# Altium schematic sheet Stepper Motor6.SchDoc
size A2; SheetNumber: 9; SheetTotal: 9
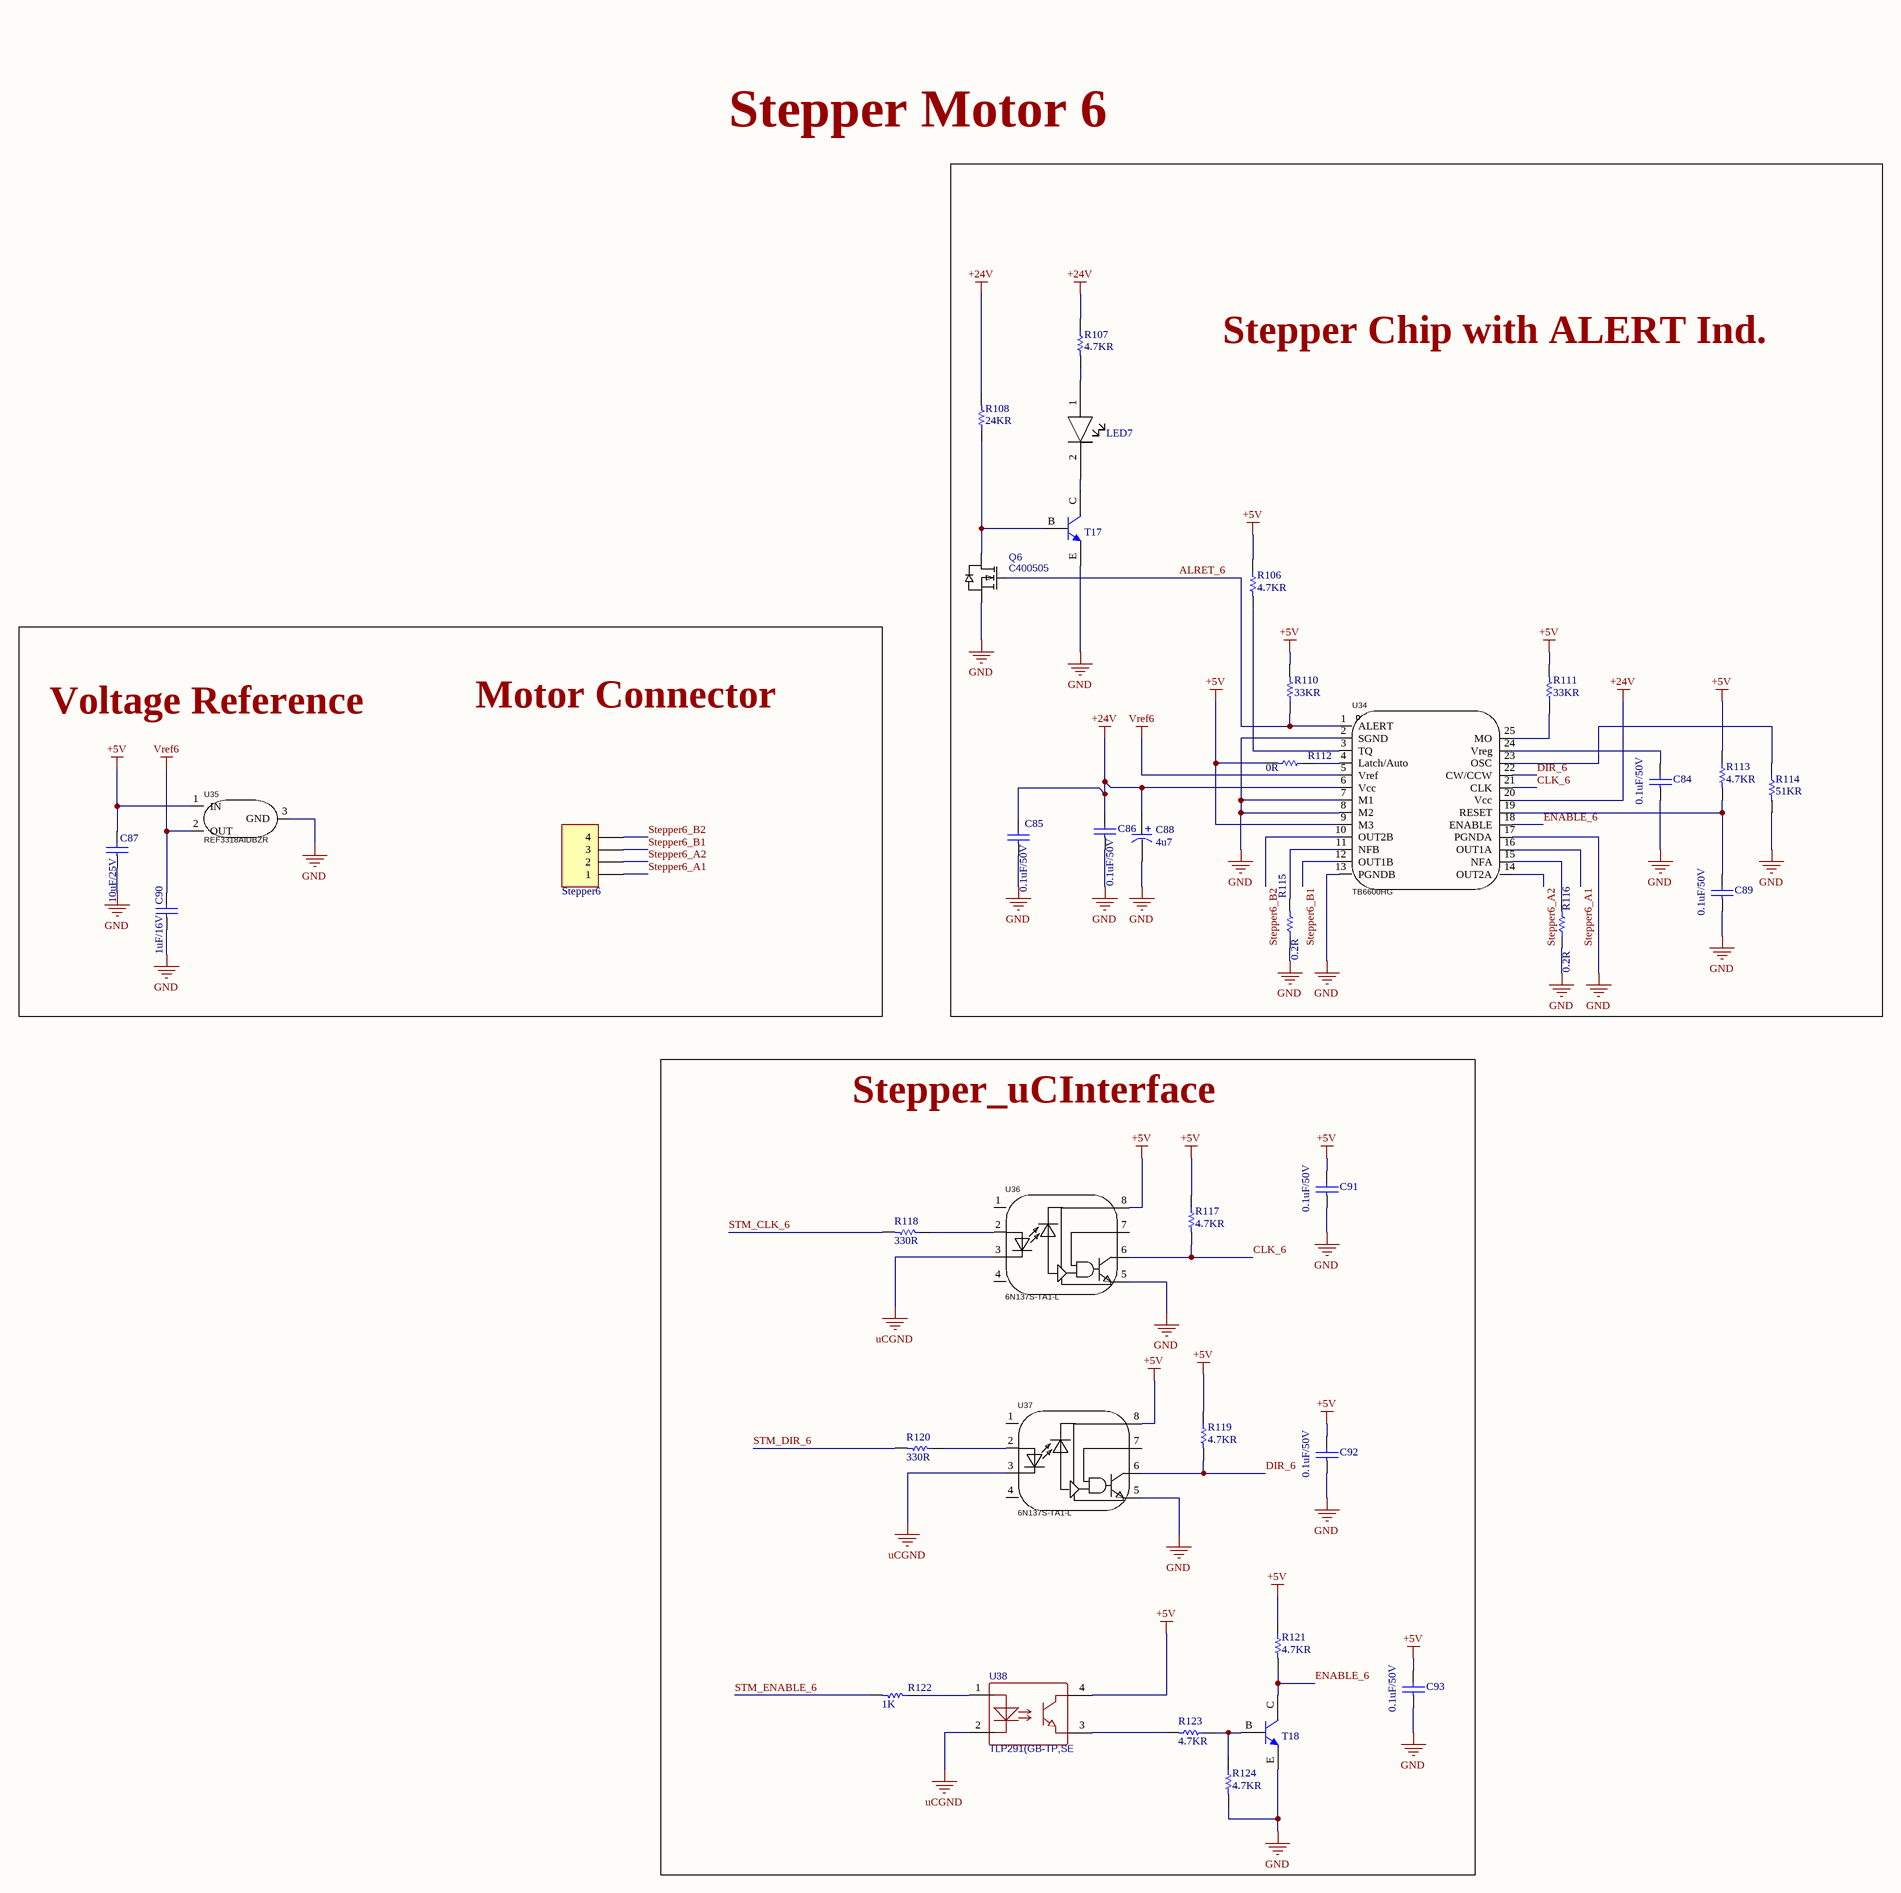
[diagram p0: Stepper Motor6.SchDoc]

## Parts
C84  0.1uF/50V  [PCBComponent_1]
C85  0.1uF/50V  [PCBComponent_1]
C86  0.1uF/50V  [PCBComponent_1]
C87  10uF/25V  [PCBComponent_1]
C88  4u7  [CAPLEAD_D6.3mm]
C89  0.1uF/50V  [PCBComponent_1]
C90  1uF/16V  [PCBComponent_1]
C91  0.1uF/50V  [PCBComponent_1]
C92  0.1uF/50V  [PCBComponent_1]
C93  0.1uF/50V  [PCBComponent_1]
LED7  1206 LED  [1206 LED]  (value not drawn)
Q6  C400505  [SOT-23-3_L2.9-W1.3-P1.90-LS2.4-BR]
R106  4.7KR  [R0402]
R107  4.7KR  [R0402]
R108  24KR  [RESC1608X06N]
R110  33KR  [RESC1608X06N]
R111  33KR  [RESC1608X06N]
R112  0R  [RESC1608X06N]
R113  4.7KR  [R0402]
R114  51KR  [R0402]
R115  0.2R  [RESC6431X12N]
R116  0.2R  [RESC6431X12N]
R117  4.7KR  [R0402]
R118  330R  [R0402]
R119  4.7KR  [R0402]
R120  330R  [R0402]
R121  4.7KR  [R0402]
R122  1K  [R0402]
R123  4.7KR  [R0402]
R124  4.7KR  [R0402]
Stepper6  Header 4 Pin Polar  [PCBComponent_1]  (value not drawn)
T17  MMBT3904 Transistor  [MMBT3904]  (value not drawn)
T18  MMBT3904 Transistor  [MMBT3904]  (value not drawn)
U34  TB6600HG  [HZIP25-P-1.0_TB6600HG - HEATSINK]
U35  REF3318AIDBZR  [SOT-23-3_L2.9-W1.3-P1.90-LS2.4-BR]
U36  6N137S-TA1-L  [SOP-8_L9.8-W6.6-P2.54-LS10.3-BL]
U37  6N137S-TA1-L  [SOP-8_L9.8-W6.6-P2.54-LS10.3-BL]
U38  TLP291(GB-TP,SE  [SOP-4-1.27mm]

## Blocks framed on the sheet
Stepper Chip with ALERT Ind.: C84-C86 C88 C89 LED7 Q6 R106-R108 R110-R116 T17 U34
Stepper_uCInterface: C91-C93 R117-R124 T18 U36-U38

## Nets
+5V: C87.2 C91.2 C92.2 C93.2 R106.1 R110.2 R111.2 R112.2 R113.1 R117.1 R119.1 R121.1 U34.9(M3) U35.1(IN) U36.8 U37.8 U38.4
+24V: C85.2 C86.2 C88.1 R107.1 R108.2 U34.6(Vcc) U34.20(Vcc)
GND: C84.1 C85.1 C86.1 C87.1 C88.2 C89.1 C90.1 C91.1 C92.1 C93.1 Q6.2(S) R114.2 R115.1 R116.1 R124.2 T17.E T18.E U34.2(SGND) U34.7(M1) U34.8(M2) U34.13(PGNDB) U34.17(PGNDA) U35.3(GND) U36.5 U37.5
uCGND: U36.3 U37.3 U38.2
Vref6: C90.2 U34.5(Vref) U35.2(OUT)
ALRET_6: Q6.1(G) R110.1 U34.1(ALERT)
CLK_6: R117.2 U34.21(CLK) U36.6
DIR_6: R119.2 U34.22(CW/CCW) U37.6
ENABLE_6: R121.2 T18.C U34.18(ENABLE)
Stepper6_A1: Stepper6.1 U34.16(OUT1A)
Stepper6_A2: Stepper6.2 U34.14(OUT2A)
Stepper6_B1: Stepper6.3 U34.12(OUT1B)
Stepper6_B2: Stepper6.4 U34.10(OUT2B)
STM_CLK_6: R118.2
STM_DIR_6: R120.2
STM_ENABLE_6: R122.2
NetC84_2: C84.2 U34.24(Vreg)
NetC89_2: C89.2 R113.2 U34.19(RESET)
NetLED7_1: LED7.1 R107.2
NetLED7_2: LED7.2 T17.C
NetQ6_3: Q6.3(D) R108.1 T17.B
NetR106_2: R106.2 U34.3(TQ)
NetR111_1: R111.1 U34.25(MO)
NetR112_1: R112.1 U34.4(Latch/Auto)
NetR114_1: R114.1 U34.23(OSC)
NetR115_2: R115.2 U34.11(NFB)
NetR116_2: R116.2 U34.15(NFA)
NetR118_1: R118.1 U36.2
NetR120_1: R120.1 U37.2
NetR122_1: R122.1 U38.1
NetR123_1: R123.1 R124.1 T18.B
NetR123_2: R123.2 U38.3

Not connected (* = marked no-connect by the designer): U36 1(NC) 4(NC) 7; U37 1(NC) 4(NC) 7

## Notes on the sheet
- Stepper Motor 6
- Motor Connector
- Voltage Reference

## Library data of the parts
C84-C86 C89 C91-C93 = 0603 Capacitor: C1591; Created By: NourAldin; DataSheet Link: https://eu.mouser.com/datasheet/2/400/lcc_automotive_general_en-843974.pdf; Mouser Link: https://eu.mouser.com/ProductDetail/TDK/CGA1A2X7R1H331M030BA?qs=sGAEpiMZZMs0AnBnWHyRQL8L3bkL%252bvtyS9XpSB1mk7rVV5K8%252bbxEeg%3d%3d
C87 = 0603 Capacitor: C96446; Created By: NourAldin; DataSheet Link: https://eu.mouser.com/datasheet/2/400/lcc_automotive_general_en-843974.pdf; Mouser Link: https://eu.mouser.com/ProductDetail/TDK/CGA1A2X7R1H331M030BA?qs=sGAEpiMZZMs0AnBnWHyRQL8L3bkL%252bvtyS9XpSB1mk7rVV5K8%252bbxEeg%3d%3d
C88 = A759EQ475M2AAAE160: C2691843; Manufacturer: KEMET; Supplier 1: Mouser; Manufacturer Part Number: A759EQ475M2AAAE160; RoHS: Yes; Category: Polymer Capacitors; Stock 1: 17219; Pricing 1: 1=0.97, 10=0.73, 50=0.73, 100=0.546, 1000=0.384, 10000=0.326 (USD); ComponentLink1URL: http://www.kemet.com/docfinder?Partnumber=A759EQ475M2AAAE160&src-supplier=Digikey; ComponentLink1Description: http://www.kemet.com/docfinder?Partnumber=A759EQ475M2AAAE160&src-supplier=Digikey; ComponentLink2URL: http://www.farnell.com/datasheets/2095614.pdf?src-supplier=Element14; ComponentLink2Description: http://www.farnell.com/datasheets/2095614.pdf?src-supplier=Element14; Supplier Part Number 1: 80-A759EQ475M2AAE160
C90 = 0603 Capacitor: C1592; Created By: NourAldin; DataSheet Link: https://eu.mouser.com/datasheet/2/400/lcc_automotive_general_en-843974.pdf; Mouser Link: https://eu.mouser.com/ProductDetail/TDK/CGA1A2X7R1H331M030BA?qs=sGAEpiMZZMs0AnBnWHyRQL8L3bkL%252bvtyS9XpSB1mk7rVV5K8%252bbxEeg%3d%3d
LED7 = 1206 LED: C434438; Created By: NourAldin
Q6 = BSS138_MOSFET: Manufacturer: YANGJIE(扬杰); Manufacturer Part: BSS138; Contributor: LCSC; Supplier: LCSC; Supplier Part: C400505; JLCPCB Part Class: Extended Part; spicePre: Q; spiceSymbolName: BSS138_C400505
R106 R107 R113 R117 R119 R121 R123 R124 = 0402 Resistor: C105871
R108 = 0603 Resistor: C2930081; Created By: NourAldin; Mouser Link: https://eu.mouser.com/ProductDetail/Panasonic/ERA-3AHD180V?qs=sGAEpiMZZMvdGkrng054t5mej2KPdPuFSlDBd1tSiF0%3d; DataSheet Link: https://eu.mouser.com/datasheet/2/315/AOA0000C307-1149632.pdf
R110 R111 = 0603 Resistor: C126359; Created By: NourAldin; Mouser Link: https://eu.mouser.com/ProductDetail/Panasonic/ERA-3AHD180V?qs=sGAEpiMZZMvdGkrng054t5mej2KPdPuFSlDBd1tSiF0%3d; DataSheet Link: https://eu.mouser.com/datasheet/2/315/AOA0000C307-1149632.pdf
R112 = 0603 Resistor: C100044; Created By: NourAldin; Mouser Link: https://eu.mouser.com/ProductDetail/Panasonic/ERA-3AHD180V?qs=sGAEpiMZZMvdGkrng054t5mej2KPdPuFSlDBd1tSiF0%3d; DataSheet Link: https://eu.mouser.com/datasheet/2/315/AOA0000C307-1149632.pdf
R114 = 0402 Resistor: C107230
R115 R116 = 2512 Resistor: C2903473; Created By: NourAldin; Mouser Link: https://eu.mouser.com/ProductDetail/Bourns/CSS2H-2512K-2L00F?qs=sGAEpiMZZMukHu%252bjC5l7YewuupLM8jZrvWs15Y6t0rY%3D&fbclid=IwAR0ZD_uc1Y03YG_KyYG8NxrpBzYgFzVeevvjxrlqtGWJ1HKz-jrYfqlFWCw; DataSheet Link: https://eu.mouser.com/datasheet/2/54/ss2h-2512-1302652.pdf
R118 R120 = 0402 Resistor: C105875
R122 = 0402 Resistor: C106235
Stepper6 = Header 4 Pin Polar: C144395
T17 T18 = MMBT3904 Transistor: C108429; Created By: NourAldin
U34 = TB6600HG: C66042; Manufacturer: TOSHIBA(东芝); Add into BOM: yes; Symbol: TB6600HG; Device: TB6600HG; LCSC Part Name: 4.5A 42V电机驱动芯片; Supplier Part: C66042; Manufacturer Part: TB6600HG; Supplier Footprint: HZIP-25-P-1mm; JLCPCB Part Class: Extended Part; Datasheet: https://atta.szlcsc.com/upload/public/pdf/source/20170511/1494500127812.pdf; Supplier: LCSC; Convert to PCB: yes
U35 = REF3318AIDBZR: C115877; Manufacturer: TI(德州仪器); Add into BOM: yes; Output Type: Fixed; Input Voltage: 2V~5.5V; Output Voltage: 1.8V; Output Current: 5mA; Tolerance: ±0.15%; Temperature Coefficient: 30ppm/℃; Reference Type: series connection; Supply Current: 8.5uA; Noise - 1/10Hz to 10Hz: 50uVp-p; Symbol: REF3318AIDBZR; Device: REF3318AIDBZR; LCSC Part Name: REF3318AIDBZR; Supplier Part: C115877; Manufacturer Part: REF3318AIDBZR; Supplier Footprint: SOT-23; JLCPCB Part Class: Extended Part; Datasheet: https://www.ti.com/cn/lit/gpn/ref3318; Supplier: LCSC; Convert to PCB: yes; Noise - 10Hz to 10kHz: -; Operating Temperature: -40℃~+125℃@(Ta)
U36 U37 = 6N137S-TA1-L: C92651; Manufacturer: LITEON(光宝); Add into BOM: yes; Input Type: DC; Supply Voltage: 4.5V~5.5V; Common Mode Transient Immunity (CMTI): 10kV/us; Data Rate: 15Mbit/s; Propagation Delay tpLH/tpHL: 32ns；40ns; Number of Channels: 1; Symbol: 6N137S-TA1; Device: 6N137S-TA1-L; LCSC Part Name: DC输入 1通道; Supplier Part: C92651; Manufacturer Part: 6N137S-TA1-L; Supplier Footprint: SOP-8-2.54mm; JLCPCB Part Class: Extended Part; Datasheet: https://atta.szlcsc.com/upload/public/pdf/source/20191018/C92651_D1F9F6F1F10C7EC7C3739E5ECB700036.pdf; Supplier: LCSC; Convert to PCB: yes; Operating Temperature: -40℃~+85℃
U38 = TLP291(GB-TP,SE(T: C55144; BOM_Manufacturer: TOSHIBA(东芝); BOM_Supplier: LCSC; Manufacturer Part Number: TLP291(GB-TP,SE; Supplier Part Number 2: C55144; BOM_JLCPCB Part Class: Extended Part; LCSC Link: https://www.lcsc.com/product-detail/Optocouplers-Phototransistor-Output_TOSHIBA-TLP291-GB-TP-SE_C55144.html; spiceSymbolName: TLP291(GB-TP,SE(T